# Altium schematic sheet ip_phone_b_miscellaneous.SchDoc: MISCELLANEOUS
size A3; SheetNumber: 2; SheetTotal: 6
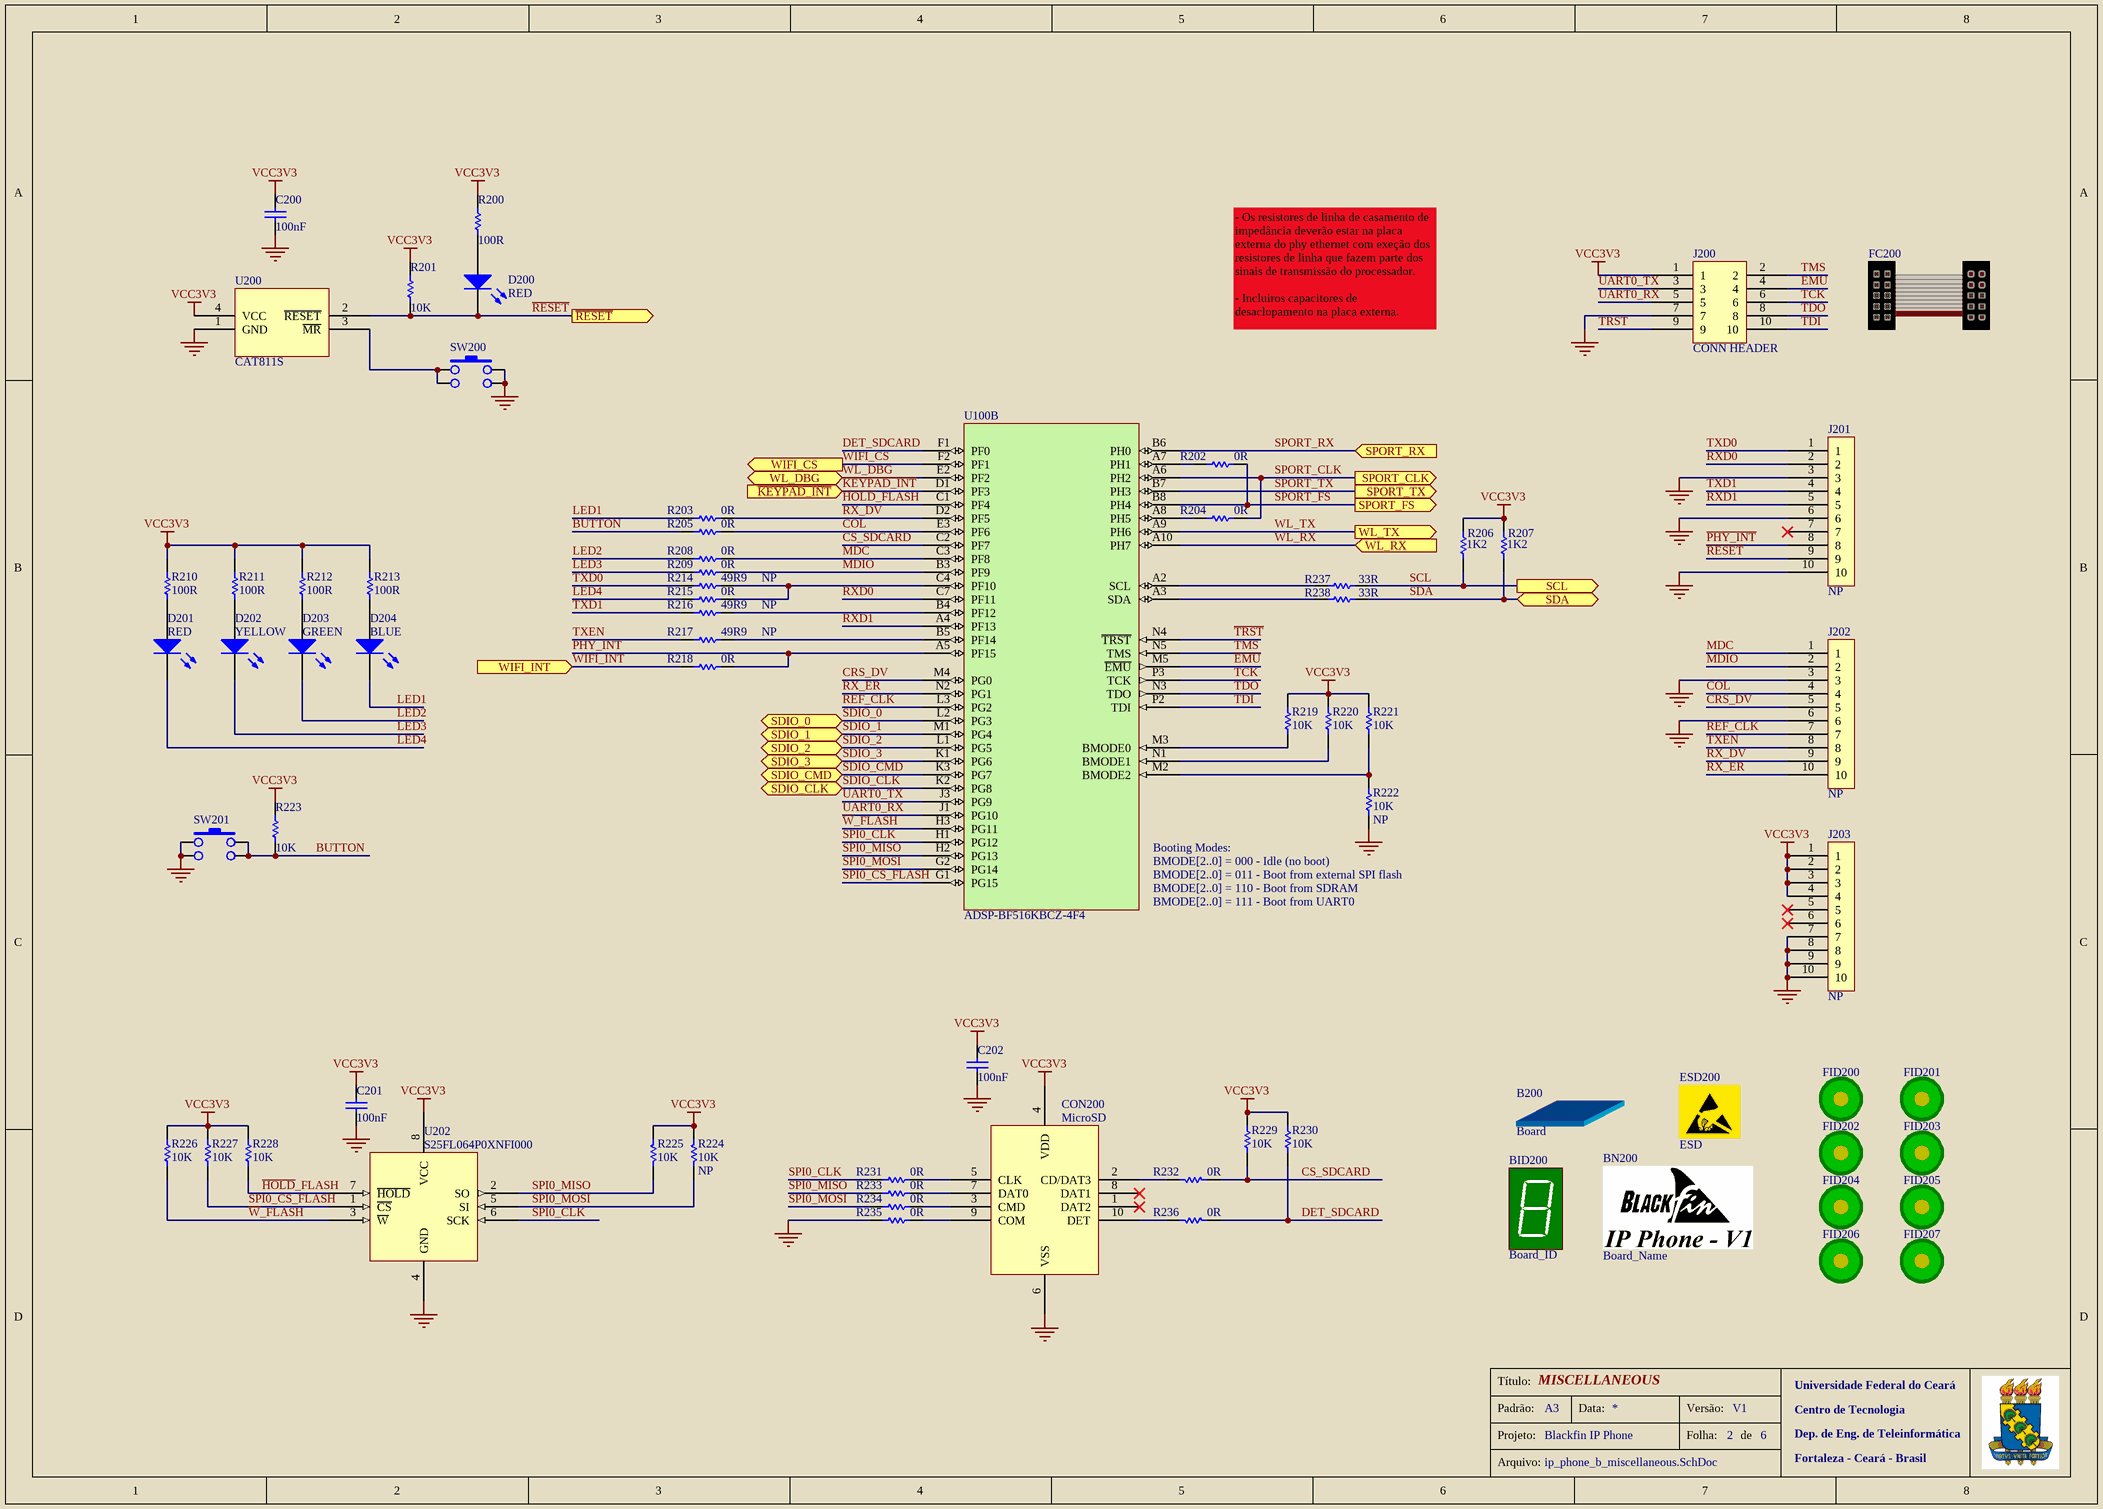
[diagram p0: ip_phone_b_miscellaneous.SchDoc]

## Parts
B200  Board  (no BOM)
BID200  Board_ID  [BOARD_ID]  (no BOM)
BN200  Board_Name  [LOGO]  (no BOM)
C200  100nF  [CC1005-0402]
C201  100nF  [CC1005-0402]
C202  100nF  [CC1005-0402]
CON200  MicroSD  [MICRO_SD]
D200  RED  [LED_0603]
D201  RED  [LED_0603]
D202  YELLOW  [LED_0603]
D203  GREEN  [LED_0603]
D204  BLUE  [LED_0603]
ESD200  ESD  [ESD]  (no BOM)
FC200  Flat Cable  (value not drawn)  (mechanical)
FID200  Fiducial  [Fiducial]  (value not drawn)  (no BOM)
FID201  Fiducial  [Fiducial]  (value not drawn)  (no BOM)
FID202  Fiducial  [Fiducial]  (value not drawn)  (no BOM)
FID203  Fiducial  [Fiducial]  (value not drawn)  (no BOM)
FID204  Fiducial  [Fiducial]  (value not drawn)  (no BOM)
FID205  Fiducial  [Fiducial]  (value not drawn)  (no BOM)
FID206  Fiducial  [Fiducial]  (value not drawn)  (no BOM)
FID207  Fiducial  [Fiducial]  (value not drawn)  (no BOM)
J200  CONN HEADER  [CON_JTAG]
J201  CONN HEADER  [CONECTOR_10_PIN]  (value not drawn)
J202  CONN HEADER  [CONECTOR_10_PIN]  (value not drawn)
J203  CONN HEADER  [CONECTOR_10_PIN]  (value not drawn)
R200  100R  [CR1608-0603]
R201  10K  [CR1005-0402]
R202  0R  [CR1005-0402]
R203  0R  [CR1005-0402]
R204  0R  [CR1005-0402]
R205  0R  [CR1005-0402]
R206  1K2  [CR1005-0402]
R207  1K2  [CR1005-0402]
R208  0R  [CR1005-0402]
R209  0R  [CR1005-0402]
R210  100R  [CR1608-0603]
R211  100R  [CR1608-0603]
R212  100R  [CR1608-0603]
R213  100R  [CR1608-0603]
R214  49R9  [CR1005-0402_NP]
R215  0R  [CR1005-0402]
R216  49R9  [CR1005-0402_NP]
R217  49R9  [CR1005-0402_NP]
R218  0R  [CR1005-0402]
R219  10K  [CR1005-0402]
R220  10K  [CR1005-0402]
R221  10K  [CR1005-0402]
R222  10K  [CR1005-0402_NP]
R223  10K  [CR1005-0402]
R224  10K  [CR1005-0402_NP]
R225  10K  [CR1005-0402]
R226  10K  [CR1005-0402]
R227  10K  [CR1005-0402]
R228  10K  [CR1005-0402]
R229  10K  [CR1005-0402]
R230  10K  [CR1005-0402]
R231  0R  [CR1005-0402]
R232  0R  [CR1005-0402]
R233  0R  [CR1005-0402]
R234  0R  [CR1005-0402]
R235  0R  [CR1005-0402]
R236  0R  [CR1005-0402]
R237  33R  [CR1005-0402]
R238  33R  [CR1005-0402]
SW200  SW  [PUSH-PTS525]  (value not drawn)
SW201  SW  [PUSH-PTS525]  (value not drawn)
U100  ADSP-BF516KBCZ-4F4  [BGA168]  (part B of 3)
U200  CAT811S  [SOT-143]
U202  S25FL064P0XNFI000  [WSON8]

## Ports
SCL (out), SDA (bidir), SDIO_0 (bidir), SDIO_1 (bidir), SDIO_2 (bidir), SDIO_3 (bidir), SDIO_CLK (bidir), SDIO_CMD (bidir), SPORT_CLK (out), SPORT_FS (out), SPORT_RX (in), SPORT_TX (out), WIFI_CS (out), WIFI_INT (in), WL_DBG (bidir), WL_RX (in), WL_TX (out), ~{KEYPAD_INT} (in), ~{RESET} (out)

## Nets
GND: C200.1 C201.1 C202.1 CON200.6(VSS) J200.7 J201.3 J201.6 J201.10 J202.3 J202.6 J203.7 J203.8 J203.9 J203.10 R222.1 R235.1 SW200.1 SW200.2 SW201.1 SW201.2 U200.1(GND) U202.4(GND)
VCC3V3: C200.2 C201.2 C202.2 CON200.4(VDD) J200.1 J203.1 J203.2 J203.3 J203.4 R200.2 R201.2 R206.1 R207.1 R210.2 R211.2 R212.2 R213.2 R219.2 R220.2 R221.2 R223.2 R224.2 R225.2 R226.2 R227.2 R228.2 R229.2 R230.2 U200.4(VCC) U202.8(VCC)
~{EMU}: J200.4 U100.M5(~{EMU})
~{HOLD}_FLASH: R228.1 U100.C1(PF4) U202.7(~{HOLD})
~{KEYPAD_INT}: U100.D1(PF3) ; port ~{KEYPAD_INT}
~{RESET}: D200.2(K) J201.9 R201.1 U200.2(~{RESET}) ; port ~{RESET}
~{TRST}: J200.9 U100.N4(~{TRST})
~{W}_FLASH: R226.1 U100.H3(PG11) U202.3(~{W})
BUTTON: R205.1 R223.1 SW201.3 SW201.4
COL: J202.4 R205.2 U100.E3(PF6)
CRS_DV: J202.5 U100.M4(PG0)
CS_SDCARD: R229.1 R232.1 U100.C2(PF7)
DET_SDCARD: R230.1 R236.1 U100.F1(PF0)
LED1: D204.2(K) R203.1
LED2: D203.2(K) R208.1
LED3: D202.2(K) R209.1
LED4: D201.2(K) R215.1
MDC: J202.1 R208.2 U100.C3(PF8)
MDIO: J202.2 R209.2 U100.B3(PF9)
~{PHY_INT}: J201.8 R218.2 U100.A5(PF15)
REF_CLK: J202.7 U100.L3(PG2)
RX_DV: J202.9 R203.2 U100.D2(PF5)
RX_ER: J202.10 U100.N2(PG1)
RXD0: J201.2 U100.C7(PF11)
RXD1: J201.5 U100.A4(PF13)
SCL: R206.2 R237.2 ; port SCL
SDA: R207.2 R238.2 ; port SDA
SDIO_0: U100.L2(PG3) ; port SDIO_0
SDIO_1: U100.M1(PG4) ; port SDIO_1
SDIO_2: U100.L1(PG5) ; port SDIO_2
SDIO_3: U100.K1(PG6) ; port SDIO_3
SDIO_CLK: U100.K2(PG8) ; port SDIO_CLK
SDIO_CMD: U100.K3(PG7) ; port SDIO_CMD
SPI0~{_CS}_FLASH: R227.1 U100.G1(PG15) U202.1(~{CS})
SPI0_CLK: R231.1 U100.H1(PG12) U202.6(SCK)
SPI0_MISO: R225.1 R233.1 U100.H2(PG13) U202.2(SO)
SPI0_MOSI: R224.1 R234.1 U100.G2(PG14) U202.5(SI)
SPORT_CLK: R204.2 U100.A6(PH2) ; port SPORT_CLK
SPORT_FS: R202.2 U100.B8(PH4) ; port SPORT_FS
SPORT_RX: U100.B6(PH0) ; port SPORT_RX
SPORT_TX: U100.B7(PH3) ; port SPORT_TX
TCK: J200.6 U100.P3(TCK)
TDI: J200.10 U100.P2(TDI)
TDO: J200.8 U100.N3(TDO)
TMS: J200.2 U100.N5(TMS)
TXD0: J201.1 R214.1
TXD1: J201.4 R216.1
TXEN: J202.8 R217.1
UART0_RX: J200.5 U100.J1(PG10)
UART0_TX: J200.3 U100.J3(PG9)
WIFI_CS: U100.F2(PF1) ; port WIFI_CS
WIFI_INT: R218.1 ; port WIFI_INT
WL_DBG: U100.E2(PF2) ; port WL_DBG
WL_RX: U100.A10(PH7) ; port WL_RX
WL_TX: U100.A9(PH6) ; port WL_TX
NetCON200_2: CON200.2(CD/DAT3) R232.2
NetCON200_3: CON200.3(CMD) R234.2
NetCON200_5: CON200.5(CLK) R231.2
NetCON200_7: CON200.7(DAT0) R233.2
NetCON200_9: CON200.9(COM) R235.2
NetCON200_10: CON200.10(DET) R236.2
NetD200_1: D200.1(A) R200.1
NetD201_1: D201.1(A) R210.1
NetD202_1: D202.1(A) R211.1
NetD203_1: D203.1(A) R212.1
NetD204_1: D204.1(A) R213.1
NetR202_1: R202.1 U100.A7(PH1)
NetR204_1: R204.1 U100.A8(PH5)
NetR214_2: R214.2 R215.2 U100.C4(PF10)
NetR216_2: R216.2 U100.B4(PF12)
NetR217_2: R217.2 U100.B5(PF14)
NetR219_1: R219.1 U100.M3(BMODE0)
NetR220_1: R220.1 U100.N1(BMODE1)
NetR221_1: R221.1 R222.2 U100.M2(BMODE2)
NetR237_1: R237.1 U100.A2(SCL)
NetR238_1: R238.1 U100.A3(SDA)
NetSW200_3: SW200.3 SW200.4 U200.3(~{MR})

Not connected (* = marked no-connect by the designer): CON200 1(DAT2)* 8(DAT1)*; J201 7*; J203 5* 6*

## Notes on the sheet
- - Os resistores de linha de casamento de impedância deverão estar na placa externa do phy ethernet com exeção dos resistores de linha que fazem parte dos sinais de transmissão do processador.
  - Incluiros capacitores de desaclopamento na placa externa.
- (near U100) Booting Modes:
- (near U100) BMODE[2..0] = 000 - Idle (no boot)
- (near U100) BMODE[2..0] = 011 - Boot from external SPI flash
- (near U100) BMODE[2..0] = 110 - Boot from SDRAM
- (near U100) BMODE[2..0] = 111 - Boot from UART0
- Título:
- Universidade Federal do Ceará
- Padrão:
- Projeto:
- A3
- Blackfin IP Phone
- Data:
- Versão:
- Folha:
- V1
- de
- Centro de Tecnologia
- Dep. de Eng. de Teleinformática
- Fortaleza - Ceará - Brasil
- Arquivo:

## Library data of the parts
BID200 = Board_ID: eVendor: NÃO SE APLICA; eVendorPrice: 0,00; eVendorPart#: NÃO SE APLICA; Part#: NÃO SE APLICA; Manufacturer: NÃO SE APLICA; MOQ: 1000; MSRP: 0,00
BN200 = Board_Name: eVendor: NÃO SE APLICA; eVendorPrice: 0,00; eVendorPart#: NÃO SE APLICA; Manufacturer: NÃO SE APLICA; MOQ: 1000; MSRP: 0,00; Part#: NÃO SE APLICA
C200-C202 = Capacitor: MLCC - SMD/SMT 0.1UF 16V 10% 0402; eVendorPart#: 810-C1005X7R1C104K; Manufacturer: TDK; Part#: C1005X7R1C104KT; eVendor: Mouser; eVendorPrice: 0,03; MSRP: 0,005; MOQ: 1000
CON200 = MicroSD: CONN MEMORY CARD SD SMD; Manufacturer: AVX Corporation; Part#: 045138008010890+; eVendorPart#: 478-4965-1-ND; MSRP: 2,394; eVendorPrice: 3,86; eVendor: Digikey; MOQ: 1000
D200 D201 = LED: Part#: APT1608SURCK; Manufacturer: Kingbright; eVendorPart#: 604-APT1608SURCK; eVendor: Mouser; eVendorPrice: 0,16; MSRP: 0,06; MOQ: 1000
D202 = LED: Part#: APT1608SYCK; Manufacturer: Kingbright; eVendorPart#: 604-APT1608SYCK; eVendor: Mouser; eVendorPrice: 0,16; MSRP: 0,06; MOQ: 1000
D203 = LED: Part#: APT1608CGCK; Manufacturer: Kingbright; eVendorPart#: 604-APT1608CGCK; eVendor: Mouser; eVendorPrice: 0,17; MSRP: 0,067; MOQ: 1000
D204 = LED: Part#: EL-19-21/BHC-AN1P2/3T; Manufacturer: Everlight; eVendorPart#: 638-192BHC-AN1P23T; eVendor: Mouser; eVendorPrice: 0,22; MSRP: 0,085; MOQ: 1000
ESD200 = ESD: eVendor: NÃO SE APLICA; eVendorPrice: 0,00; eVendorPart#: NÃO SE APLICA; Part#: NÃO SE APLICA; MOQ: 0,00; MSRP: 0,00; Manufacturer: NÃO SE APLICA
FC200 = Flat_Cable: eVendorPart#: SAM8218-ND; Manufacturer: Samtec; eVendor: Digikey; MSRP: 6,20; eVendorPrice: 10,76; MOQ: 1000; Part#: SAM8218-ND
FID200-FID207 = Fiducial: eVendorPart#: NÃO SE APLICA; MSRP: 0,00; Manufacturer: NÃO SE APLICA; MOQ: 1000; Part#: NÃO SE APLICA; eVendor: NÃO SE APLICA; eVendorPrice: 0,00
J200 = Conector JTAG: CONN HEADER .050" 5x2; eVendorPart#: S9012E-05-ND; Manufacturer: Sullins; Part#: GRPB052VWQS-RC; eVendor: Digikey; eVendorPrice: 0,95; MSRP: 0,47; MOQ: 1000
J201-J203 = Conector 10pin: CONN HEADER .050" 10POS PCB GOLD; eVendorPart#: S9014E-10-ND; Manufacturer: Sullins Connector Solutions; Part#: GRPB101VWVN-RC; eVendor: Digikey; eVendorPrice: 0,66; MSRP: 0,32775; MOQ: 1000; NP: NP
R200 R210-R213 = Resistor: Thick Film Resistors 1/16WATT 100R 0402; eVendorPart#: 652-CR0603-JW-101GLF; Manufacturer: Bourns; Part#: CR0603-JW-101GLF; eVendor: Mouser; eVendorPrice: 0,06; MSRP: 0,01; MOQ: 1000
R201 R219-R230 = Resistor: Thick Film Resistors SMD 0402 10K 5%  1/16 W; eVendorPart#: 311-10KJRCT-ND; Manufacturer: Yageo; Part#: RC0402JR-0710KL; eVendor: Digikey; eVendorPrice: 0,012; MSRP: 0,00253; MOQ: 1000
  R222 R224: NP: NP
R202-R205 R208 R209 R215 R218 R231-R236 = Resistor: Thick Film Resistors 0402 1/16W Jumper; eVendorPart#: 667-ERJ-2GE0R00X; Manufacturer: Panasonic Electronic Components; Part#: ERJ-2GE0R00X; eVendor: Mouser; eVendorPrice: 0,05; MSRP: 0,004; MOQ: 1000
R206 R207 = Resistor: Thick Film Resistors SMD 0402 1K2 5%  1/16 W; eVendorPart#: 311-1.2KJRCT-ND; Manufacturer: Yageo; Part#: RC0402JR-071K2L; eVendor: Digikey; eVendorPrice: 0,012; MSRP: 0,00253; MOQ: 1000
R214 R216 R217 = Resistor: Thick Film Resistors - SMD 1/16watt 49.9ohms 1% 0402; eVendorPart#: 71-CRCW0402-49.9-E3; Manufacturer: Vishay/Dale; Part#: CRCW040249R9FKED; eVendor: Mouser; eVendorPrice: 0,07; MSRP: 0,015; MOQ: 1000; NP: NP
R237 R238 = Resistor: Thick Film Resistors SMD 0402 33R 5%  1/16 W; eVendorPart#: 311-33JRCT-ND; Manufacturer: Yageo; Part#: RC0402JR-0733RL; eVendor: Digikey; eVendorPrice: 0,012; MSRP: 0,00253; MOQ: 1000
SW200 SW201 = SWITCH_PUSH_NA_SMD: Switch tact, SMT, SPST, 160gf, 5.25 mm L x 5.25 mm W x 1.5 mm H; Manufacturer: C&K Components; Part#: PTS525SM10SMTR LFS; eVendorPart#: 611-PTS525SM10-LFS; eVendor: Mouser; eVendorPrice: 0,48; MSRP: 0,244; MOQ: 1000
U100 = ADSP-BF516KBCZ-4F4: Low Power Blackfin with Advanced Embedded Connectivity; Manufacturer: Analog Device; eVendor: Avnet; eVendorPrice: 19,42; MSRP: 14,15; eVendorPart#: ADSP-BF516KBCZ-4F4; MOQ: 500; Part#: ADSP-BF516KBCZ-4F4
U200 = CAT811S: IC Supervisor MPU 2.93V  SOT-143; Part#: CAT811STBI-GT3; Manufacturer: ON Semiconductor; eVendorPart#: 698-CAT811STBI-GT3; eVendor: Mouser; eVendorPrice: 0,22; MSRP: 0,156; MOQ: 1000
U202 = S25FL064P0XNFI000: Flash Mem Serial-SPI 3V/3.3V 64M-Bit 64M x 1 8ns 8-Pin WSON Tray; Manufacturer: Spansion; eVendor: Avnet; eVendorPrice: 1,99; MSRP: 1,88; eVendorPart#: S25FL064P0XNFI000; Part#: S25FL064P0XNFI000; MOQ: 100
B200 = Board: eVendor: *; eVendorPart#: *; Part#: *; eVendorPrice: *; MOQ: *; MSRP: *; Manufacturer: *